# Altium schematic sheet MCUCircuit.SchDoc
size A2; SheetNumber: 5; SheetTotal: 9
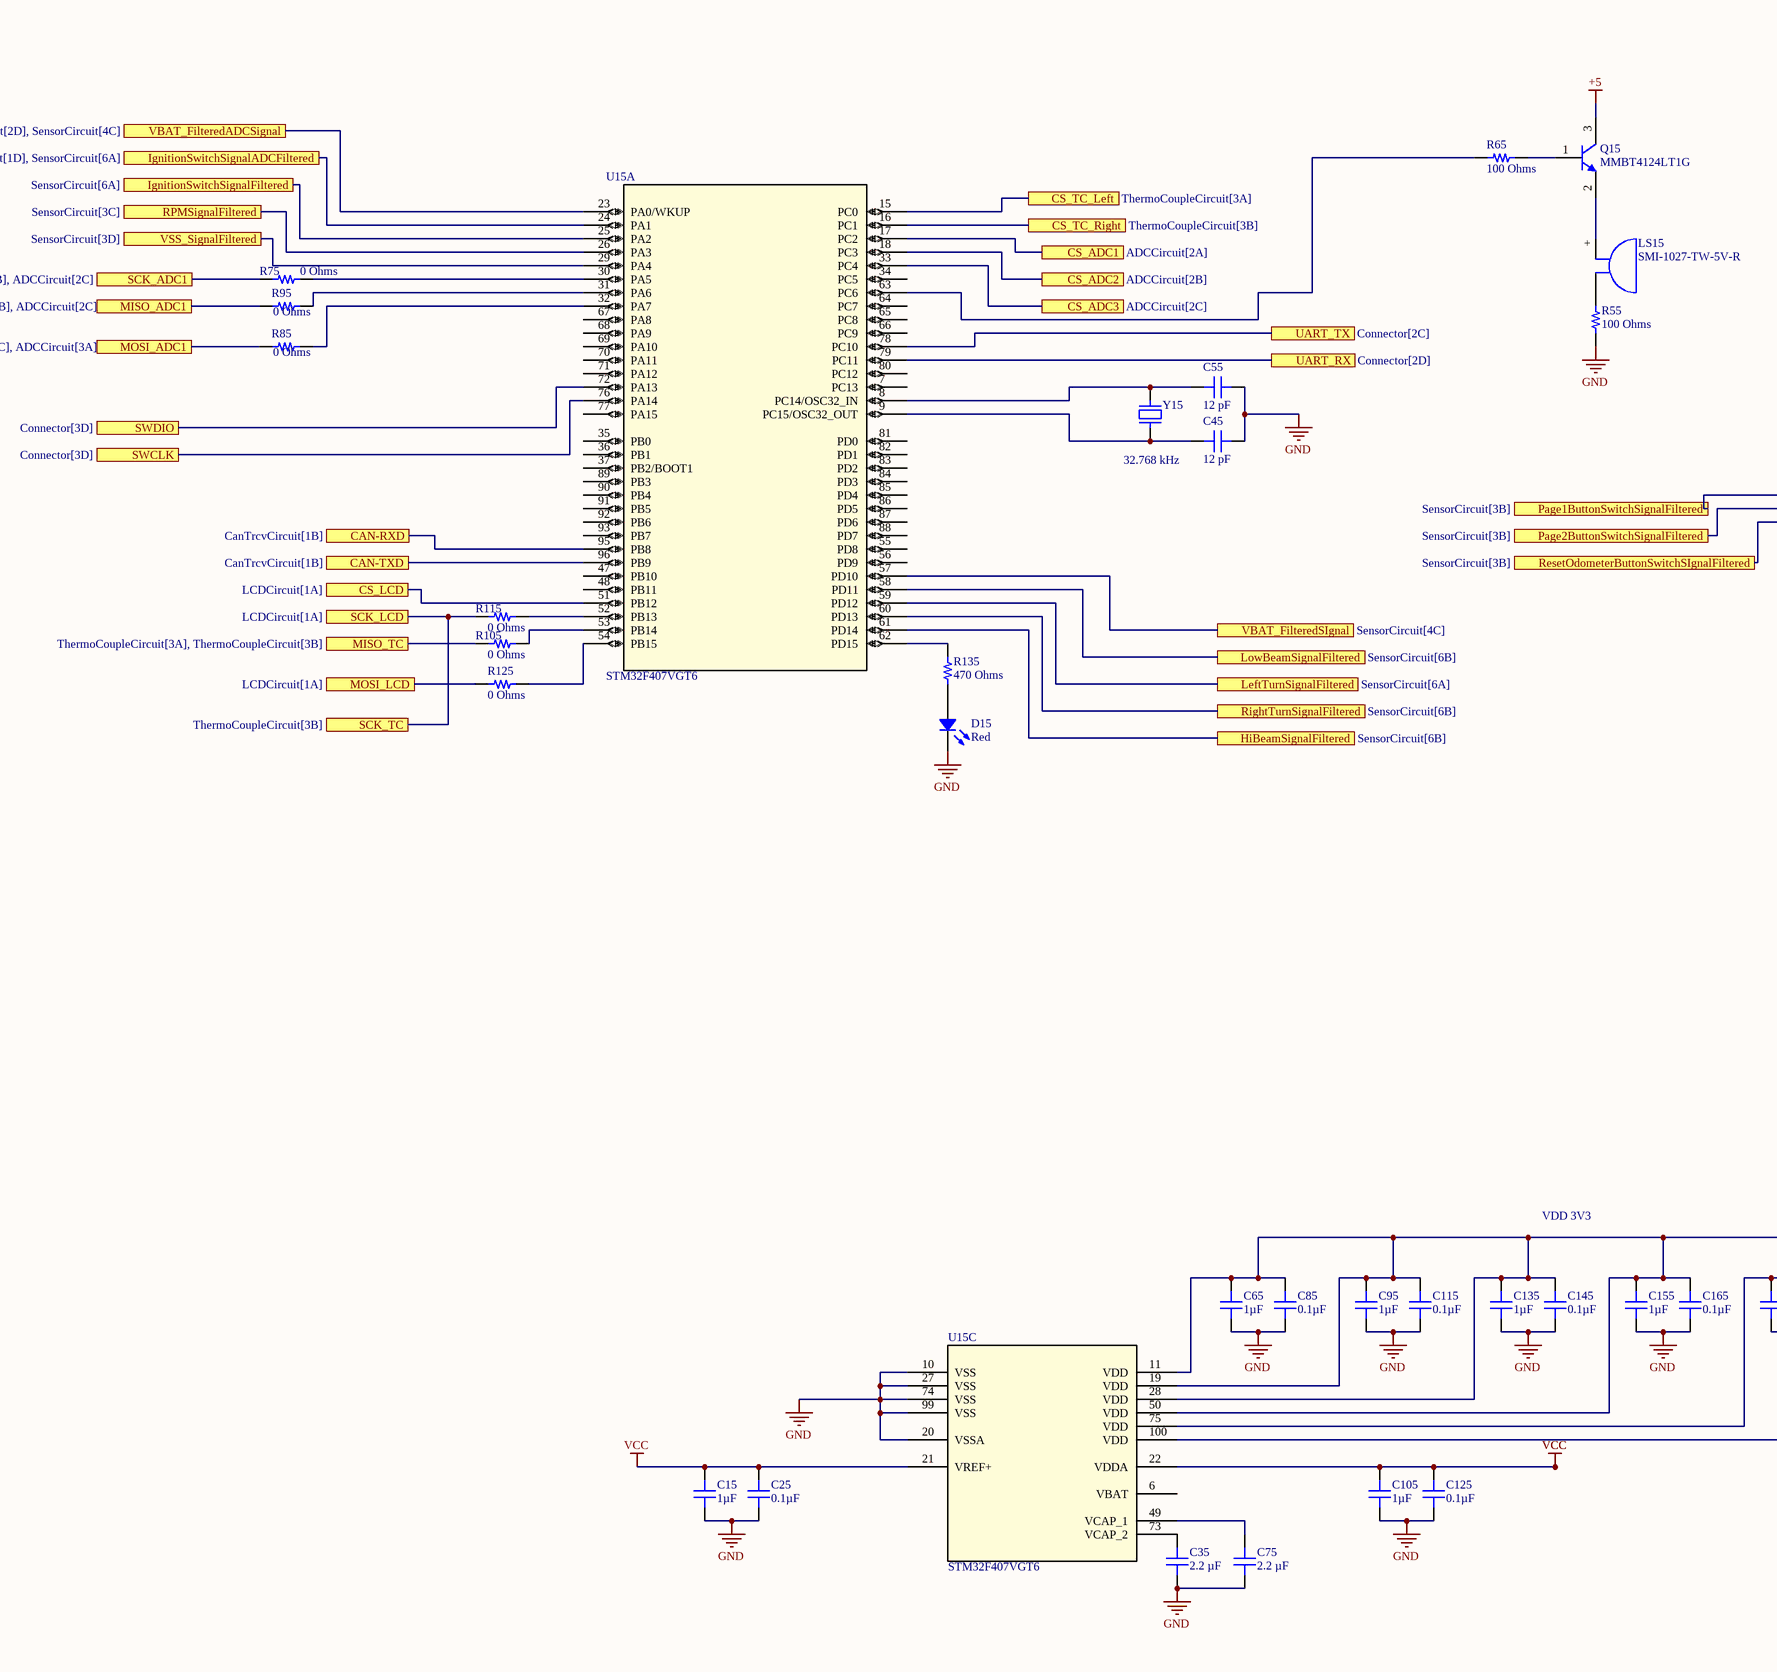
[diagram p0: MCUCircuit.SchDoc, left]
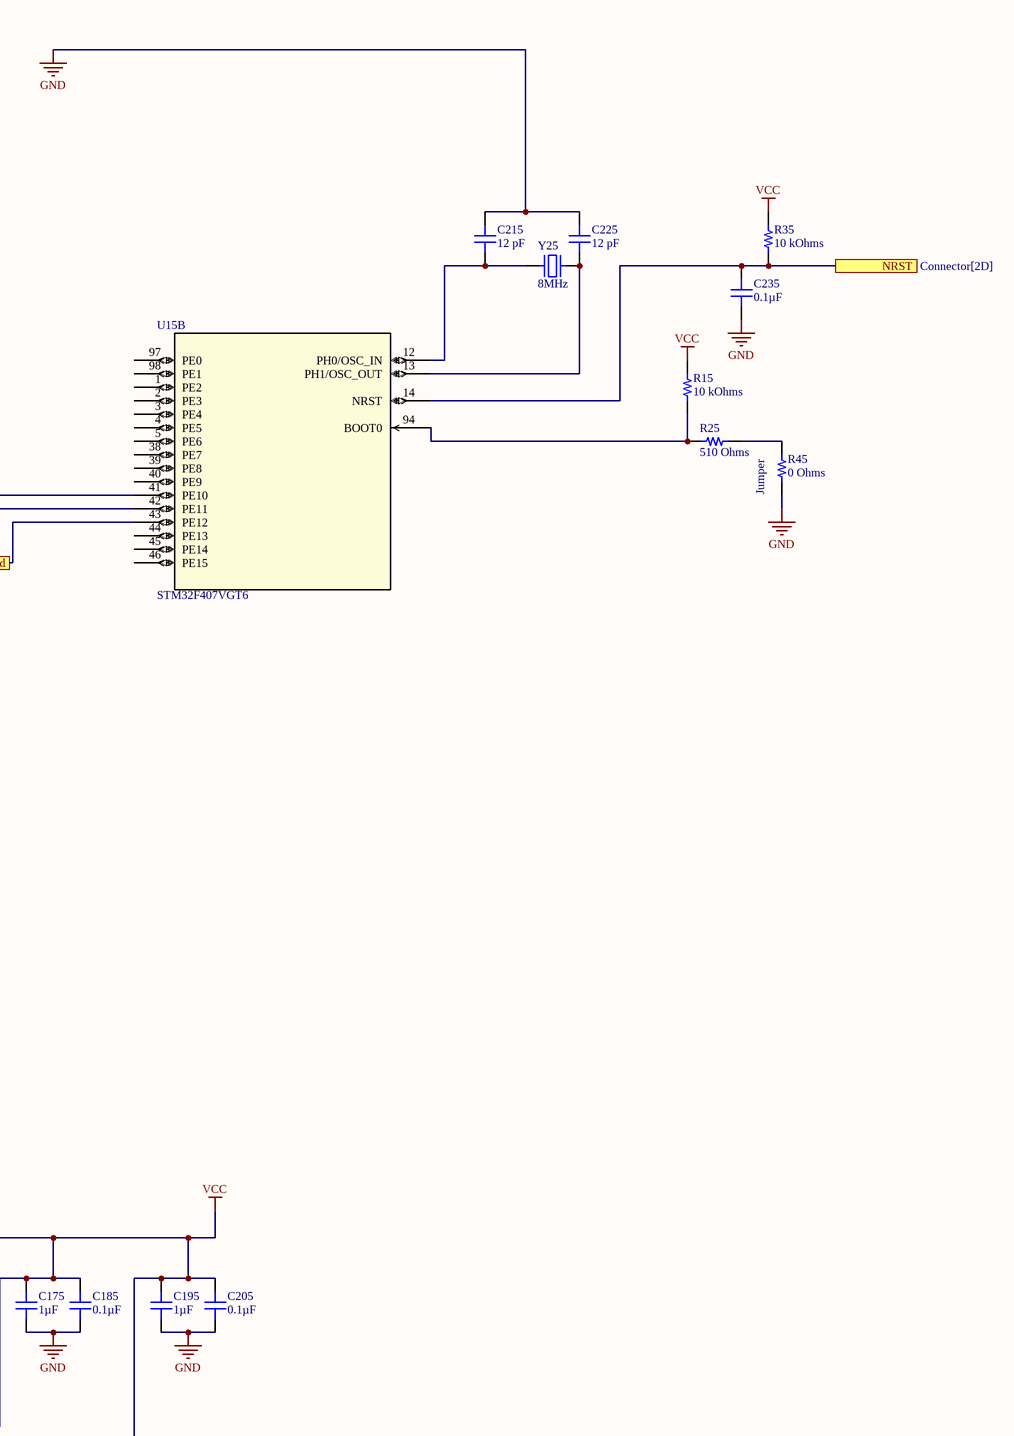
[diagram p1: MCUCircuit.SchDoc, right]

## Parts
C15  1µF  [C0805]
C25  0.1µF  [C0805]
C35  2.2 µF  [C0805]
C45  12 pF  [C0805]
C55  12 pF  [C0805]
C65  1µF  [C0805]
C75  2.2 µF  [C0805]
C85  0.1µF  [C0805]
C95  1µF  [C0805]
C105  1µF  [C0805]
C115  0.1µF  [C0805]
C125  0.1µF  [C0805]
C135  1µF  [C0805]
C145  0.1µF  [C0805]
C155  1µF  [C0805]
C165  0.1µF  [C0805]
C175  1µF  [C0805]
C185  0.1µF  [C0805]
C195  1µF  [C0805]
C205  0.1µF  [C0805]
C215  12 pF  [C0805]
C225  12 pF  [C0805]
C235  0.1µF  [C0805]
D15  Red  [LED 1206_3216 RED]
LS15  SMI-1027-TW-5V-R  [PUI Audio SMI-1027-TW-5V-R]
Q15  MMBT4124LT1G  [ON SEMI SOT-23-3]
R15  10 kOhms  [RES 0805_2012]
R25  510 Ohms  [RES 0805_2012]
R35  10 kOhms  [RES 0805_2012]
R45  0 Ohms  [RES 0805_2012]
R55  100 Ohms  [RES 0805_2012]
R65  100 Ohms  [RES 0805_2012]
R75  0 Ohms  [RES 0805_2012]
R85  0 Ohms  [RES 0805_2012]
R95  0 Ohms  [RES 0805_2012]
R105  0 Ohms  [RES 0805_2012]
R115  0 Ohms  [RES 0805_2012]
R125  0 Ohms  [RES 0805_2012]
R135  470 Ohms  [RES 0805_2012]
U15  STM32F407VGT6  [LQFP100-14x14mm]  (parts A,B,C of 3)
Y15  32.768 kHz  [MICRO CRYSTAL CM8V H0.6mm]
Y25  8MHz  [NDK NX8045GB]

## Ports
CAN-RXD (see CanTrcvCircuit[1B]), CAN-TXD (see CanTrcvCircuit[1B]), CS_ADC1 (see ADCCircuit[2A]), CS_ADC2 (see ADCCircuit[2B]), CS_ADC3 (see ADCCircuit[2C]), CS_LCD (see LCDCircuit[1A]), CS_TC_Left (see ThermoCoupleCircuit[3A]), CS_TC_Right (see ThermoCoupleCircuit[3B]), HiBeamSignalFiltered (see SensorCircuit[6B]), IgnitionSwitchSignalADCFiltered (see ADCCircuit[1D], SensorCircuit[6A]), IgnitionSwitchSignalFiltered (see SensorCircuit[6A]), LeftTurnSignalFiltered (see SensorCircuit[6A]), LowBeamSignalFiltered (see SensorCircuit[6B]), MISO_ADC1 (see ADCCircuit[2A], ADCCircuit[2B], ADCCircuit[2C]), MISO_TC (see ThermoCoupleCircuit[3A], ThermoCoupleCircuit[3B]), MOSI_ADC1 (see ADCCircuit[2B], ADCCircuit[2C], ADCCircuit[3A]), MOSI_LCD (see LCDCircuit[1A]), NRST (see Connector[2D]), Page1ButtonSwitchSignalFiltered (see SensorCircuit[3B]), Page2ButtonSwitchSignalFiltered (see SensorCircuit[3B]), ResetOdometerButtonSwitchSIgnalFiltered (see SensorCircuit[3B]), RightTurnSignalFiltered (see SensorCircuit[6B]), RPMSignalFiltered (see SensorCircuit[3C]), SCK_ADC1 (see ADCCircuit[2A], ADCCircuit[2B], ADCCircuit[2C]), SCK_LCD (see LCDCircuit[1A]), SCK_TC (see ThermoCoupleCircuit[3B]), SWCLK (see Connector[3D]), SWDIO (see Connector[3D]), UART_RX (see Connector[2D]), UART_TX (see Connector[2C]), VBAT_FilteredADCSignal (see ADCCircuit[2D], SensorCircuit[4C]), VBAT_FilteredSIgnal (see SensorCircuit[4C]), VSS_SignalFiltered (see SensorCircuit[3D])

## Nets
+5: Q15.3(C)
GND: C15.1 C25.1 C35.2 C45.2 C55.2 C65.1 C75.2 C85.1 C95.1 C105.1 C115.1 C125.1 C135.1 C145.1 C155.1 C165.1 C175.1 C185.1 C195.1 C205.1 C215.2 C225.2 C235.1 D15.2 R45.1 R55.1 U15.10(VSS) U15.20(VSSA) U15.27(VSS) U15.74(VSS) U15.99(VSS)
VCC: C15.2 C25.2 C65.2 C85.2 C95.2 C105.2 C115.2 C125.2 C135.2 C145.2 C155.2 C165.2 C175.2 C185.2 C195.2 C205.2 R15.2 R35.2 U15.11(VDD) U15.19(VDD) U15.21(VREF+) U15.22(VDDA) U15.28(VDD) U15.50(VDD) U15.75(VDD) U15.100(VDD)
CAN-RXD: U15.95(PB8) ; port CAN-RXD
CAN-TXD: U15.96(PB9) ; port CAN-TXD
CS_ADC1: U15.17(PC2) ; port CS_ADC1
CS_ADC2: U15.18(PC3) ; port CS_ADC2
CS_ADC3: U15.33(PC4) ; port CS_ADC3
CS_LCD: U15.51(PB12) ; port CS_LCD
CS_TC_Left: U15.15(PC0) ; port CS_TC_Left
CS_TC_Right: U15.16(PC1) ; port CS_TC_Right
HiBeamSignalFiltered: U15.61(PD14) ; port HiBeamSignalFiltered
IgnitionSwitchSignalADCFiltered: U15.24(PA1) ; port IgnitionSwitchSignalADCFiltered
IgnitionSwitchSignalFiltered: U15.25(PA2) ; port IgnitionSwitchSignalFiltered
LeftTurnSignalFiltered: U15.59(PD12) ; port LeftTurnSignalFiltered
LowBeamSignalFiltered: U15.58(PD11) ; port LowBeamSignalFiltered
MISO_ADC1: R95.1 ; port MISO_ADC1
MISO_TC: R105.1 ; port MISO_TC
MOSI_ADC1: R85.1 ; port MOSI_ADC1
MOSI_LCD: R125.1 ; port MOSI_LCD
NRST: C235.2 R35.1 U15.14(NRST) ; port NRST
Page1ButtonSwitchSignalFiltered: U15.41(PE10) ; port Page1ButtonSwitchSignalFiltered
Page2ButtonSwitchSignalFiltered: U15.42(PE11) ; port Page2ButtonSwitchSignalFiltered
ResetOdometerButtonSwitchSIgnalFiltered: U15.43(PE12) ; port ResetOdometerButtonSwitchSIgnalFiltered
RightTurnSignalFiltered: U15.60(PD13) ; port RightTurnSignalFiltered
RPMSignalFiltered: U15.26(PA3) ; port RPMSignalFiltered
SCK_ADC1: R75.1 ; port SCK_ADC1
SCK_LCD: R115.1 ; port SCK_LCD, port SCK_TC
SWCLK: U15.76(PA14) ; port SWCLK
SWDIO: U15.72(PA13) ; port SWDIO
UART_RX: U15.79(PC11) ; port UART_RX
UART_TX: U15.78(PC10) ; port UART_TX
VBAT_FilteredADCSignal: U15.23(PA0/WKUP) ; port VBAT_FilteredADCSignal
VBAT_FilteredSIgnal: U15.57(PD10) ; port VBAT_FilteredSIgnal
VSS_SignalFiltered: U15.29(PA4) ; port VSS_SignalFiltered
NetC35_1: C35.1 U15.73(VCAP_2)
NetC45_1: C45.1 U15.9(PC15/OSC32_OUT) Y15.1
NetC55_1: C55.1 U15.8(PC14/OSC32_IN) Y15.2
NetC75_1: C75.1 U15.49(VCAP_1)
NetC215_1: C215.1 U15.12(PH0/OSC_IN) Y25.1
NetC225_1: C225.1 U15.13(PH1/OSC_OUT) Y25.2
NetD15_1: D15.1 R135.1
NetLS15_+: LS15.+ Q15.2(E)
NetLS15_-: LS15.- R55.2
NetQ15_1: Q15.1(B) R65.1
NetR15_1: R15.1 R25.1 U15.94(BOOT0)
NetR25_2: R25.2 R45.2
NetR65_2: R65.2 U15.63(PC6)
NetR75_2: R75.2 U15.30(PA5)
NetR85_2: R85.2 U15.32(PA7)
NetR95_2: R95.2 U15.31(PA6)
NetR105_2: R105.2 U15.53(PB14)
NetR115_2: R115.2 U15.52(PB13)
NetR125_2: R125.2 U15.54(PB15)
NetR135_2: R135.2 U15.62(PD15)

Not connected (* = marked no-connect by the designer): U15 1(PE2) 2(PE3) 3(PE4) 4(PE5) 5(PE6) 6(VBAT) 7(PC13) 34(PC5) 35(PB0) 36(PB1) 37(PB2/BOOT1) 38(PE7) 39(PE8) 40(PE9) 44(PE13) 45(PE14) 46(PE15) 47(PB10) 48(PB11) 55(PD8) 56(PD9) 64(PC7) 65(PC8) 66(PC9) 67(PA8) 68(PA9) 69(PA10) 70(PA11) 71(PA12) 77(PA15) 80(PC12) 81(PD0) 82(PD1) 83(PD2) 84(PD3) 85(PD4) 86(PD5) 87(PD6) 88(PD7) 89(PB3) 90(PB4) 91(PB5) 92(PB6) 93(PB7) 97(PE0) 98(PE1)

## Notes on the sheet
- (near R45) Jumper
- VDD 3V3

## Library data of the parts
C15 C65 C95 C105 C135 C155 C175 C195 = LGC26D105MAT2S1: CAP CER 1UF 6.3V X5R 0805; manufacturer: AVX Corporation; Tolerance: ±20%; Part Number: LGC26D105MAT2S1; Value: 1µF; Applications: Bypass, Decoupling; Capacitance: 1µF; componentlink1description: Datasheet; componentlink1url: http://datasheets.avx.com/LGA.pdf; componentlink2description: DigiKey Link; componentlink2url: http://digikey.com/product-detail/en/avx-corporation/LGC26D105MAT2S1/478-6694-1-ND/2694148; Device Package: 0805 (2012 Metric); Features: Low ESL (Multi-Terminal); lastupdated: 9/2/2020 01:04:42; Lifecycle Status: Active; Minimum Order: 1; Mounting Type: Surface Mount, MLCC; Operating Temperature: -55°C ~ 85°C; Package / Case: 0805 (2012 Metric); packaging: TapeAndReel; partid: 2463; Part Status: Active; price: 0.63; series: LGC2 (LGA); Size / Dimension: 0.081" L x 0.052" W (2.06mm x 1.32mm); Supplier 1: DigiKey; Supplier Part Number 1: 478-6694-1-ND; Temperature Coefficient: X5R; Thickness (Max): 0.022" (0.55mm); Voltage - Rated: 6.3V
C25 C85 C115 C125 C145 C165 C185 C205 C235 = 08056C104JAZ2A: CAP CER 0.1UF 6.3V X7R 0805; manufacturer: AVX Corporation; Tolerance: ±5%; Part Number: 08056C104JAZ2A; Value: 0.1µF; Applications: Boardflex Sensitive; Capacitance: 0.1µF; componentlink1description: Datasheet; componentlink1url: http://datasheets.avx.com/FlexitermMLCC.pdf; componentlink2description: DigiKey Link; componentlink2url: http://digikey.com/product-detail/en/avx-corporation/08056C104JAZ2A/478-11914-1-ND/8573550; Device Package: 0805 (2012 Metric); Features: Soft Termination; lastupdated: 9/2/2020 01:04:11; Lifecycle Status: Active; Minimum Order: 1; Mounting Type: Surface Mount, MLCC; Operating Temperature: -55°C ~ 125°C; Package / Case: 0805 (2012 Metric); packaging: TapeAndReel; partid: 16783; Part Status: Active; price: 0.08; series: FLEXITERM®; Size / Dimension: 0.079" L x 0.049" W (2.01mm x 1.25mm); Supplier 1: DigiKey; Supplier Part Number 1: 478-11914-1-ND; Temperature Coefficient: X7R; Voltage - Rated: 6.3V
C35 C75 = VJ0805G225KXYTW1BC: CAP CER 2.2UF 6.3V X5R 0805; manufacturer: Vishay Vitramon; Tolerance: ±10%; Part Number: VJ0805G225KXYTW1BC; Value: 2.2 µF; Applications: General Purpose; Capacitance: 2.2 µF; componentlink1description: Datasheet; componentlink1url: https://www.vishay.com/docs/28548/vjw1bcbascomseries.pdf; componentlink2description: DigiKey Link; componentlink2url: https://www.digikey.com/en/products/detail/vishay-vitramon/VJ0805G225KXYTW1BC/8310442; Device Package: 0805 (2012 Metric); lastupdated: 2/9/2024 20:16:05; Lifecycle Status: Active; Minimum Order: 1; Mounting Type: Surface Mount, MLCC; Operating Temperature: -55°C ~ 85°C; Package / Case: 0805 (2012 Metric); packaging: TapeAndReel; partid: 3978; Part Status: Active; price: 0.08; series: VJ W1BC; Size / Dimension: 0.079" L x 0.049" W (2.00mm x 1.25mm); Supplier 1: DigiKey; Supplier Part Number 1: 720-1727-1-ND; Temperature Coefficient: X5R; Thickness (Max): 0.057" (1.45mm); Voltage - Rated: 6.3V
C45 C55 C215 C225 = C0805C120J8HAC7800: CAP CER 12PF 10V X8R 0805; manufacturer: KEMET; Tolerance: ±5%; Part Number: C0805C120J8HAC7800; Value: 12 pF; Applications: General Purpose; Capacitance: 12 pF; componentlink1description: Datasheet; componentlink1url: https://api.kemet.com/component-edge/download/datasheet/C0805C120J8HAC7800.pdf; componentlink2description: DigiKey Link; componentlink2url: https://www.digikey.com/en/products/detail/kemet/C0805C120J8HAC7800/7948305; Device Package: 0805 (2012 Metric); Features: Low ESL, High Temperature; lastupdated: 2/9/2024 20:15:06; Lifecycle Status: Active; Minimum Order: 1; Mounting Type: Surface Mount, MLCC; Operating Temperature: -55°C ~ 150°C; Package / Case: 0805 (2012 Metric); packaging: TapeAndReel; partid: 32071; Part Status: Active; price: 0.01; series: SMD Comm X8R HT150C; Size / Dimension: 0.079" L x 0.049" W (2.00mm x 1.25mm); Supplier 1: DigiKey; Supplier Part Number 1: 399-C0805C120J8HAC7800CT-ND; Temperature Coefficient: X8R; Thickness (Max): 0.035" (0.88mm); Voltage - Rated: 10V
D15 = 25-21/R6C-BR2S2B/2A: LED RED CLEAR 1206 SMD; Manufacturer: Everlight Electronics Co Ltd; Current - Test: 20mA; Lens Color: Colorless; Lens Size: 1.10mm Dia; Lens Style: Round with Domed Top; Millicandela Rating: 212.5mcd; Viewing Angle: 60°; Voltage - Forward (Vf) (Typ): 2.05V; Wavelength - Dominant: 624nm; Wavelength - Peak: 632nm; Part Number: 25-21/R6C-BR2S2B/2A; Color: Red; ComponentLink1Description: Datasheet; ComponentLink1URL: https://everlighteurope.com/index.php?controller=attachment&id_attachment=6134; ComponentLink2Description: DigiKey Link; ComponentLink2URL: https://www.digikey.com/en/products/detail/everlight-electronics-co-ltd/25-21-R6C-BR2S2B-2A/12177238; Device Package: 1206 (3216 Metric); Height (Max): 1.20mm; LastUpdated: 6/3/2024 20:00:40; Lens Transparency: Clear; Lifecycle Status: Active; Minimum Order: 1; Mounting Type: Surface Mount; Package / Case: 1206 (3216 Metric); Packaging: TapeAndReel; PartId: 1100; Part Status: Active; Price: 0.05; Series: -; Size / Dimension: 3.20mm L x 1.60mm W; Supplier 1: DigiKey; Supplier Part Number 1: 1080-25-21/R6C-BR2S2B/2ACT-ND; Supplier Device Package: 1206; Value: Red
LS15 = SMI-1027-TW-5V-R: AUDIO MAGNETIC IND 4-7V SMD; Manufacturer: PUI Audio, Inc.; Current - Supply: 30mA; Driver Circuitry: Indicator, Internally Driven; Frequency: 2.7kHz; Input Type: DC; Operating Mode: Single Tone; Port Location: Top; Ratings: Washable; Sound Pressure Level (SPL): 80dB @ 5V, 10cm; Voltage Range: 4 ~ 7V; Voltage - Rated: 5V; Part Number: SMI-1027-TW-5V-R; ComponentLink1Description: Datasheet; ComponentLink1URL: http://www.puiaudio.com/pdf/SMI-1027-TW-5V-R.pdf; ComponentLink2Description: DigiKey Link; ComponentLink2URL: http://digikey.com/product-detail/en/pui-audio-inc/SMI-1027-TW-5V-R/668-1537-1-ND/6021768; Height - Seated (Max): 0.209" (5.30mm); LastUpdated: 4/24/2020 00:38:54; Lifecycle Status: Active; Minimum Order: 1; Mounting Type: Surface Mount; Operating Temperature: -40°C ~ 85°C; Packaging: TapeAndReel; Part Status: Active; Price: 2.15; Series: SMI; Size / Dimension: 0.378" L x 0.378" W (9.60mm x 9.60mm); Supplier 1: DigiKey; Supplier Part Number 1: 668-1537-1-ND; Technology: Magnetic; Termination: Solder Pads
Q15 = MMBT4124LT1G: TRANS NPN 25V 0.2A SOT23-3; Manufacturer: ON Semiconductor; Current - Collector Cutoff (Max): 50nA (ICBO); Current - Collector (Ic) (Max): 200mA; DC Current Gain (hFE) (Min) @ Ic, Vce: 120 @ 2mA, 1V; Frequency - Transition: 300MHz; Power - Max: 225mW; Vce Saturation (Max) @ Ib, Ic: 300mV @ 5mA, 50mA; Part Number: MMBT4124LT1G; ComponentLink1Description: Datasheet; ComponentLink1URL: http://www.onsemi.com/pub/Collateral/MMBT4124LT1-D.PDF; ComponentLink2Description: DigiKey Link; ComponentLink2URL: http://digikey.com/product-detail/en/on-semiconductor/MMBT4124LT1G/MMBT4124LT1GOSCT-ND/2705123; LastUpdated: 3/11/2024 08:12:30; Lifecycle Status: Active; Minimum Order: 1; Mounting Type: Surface Mount; Operating Temperature: -55°C ~ 150°C (TJ); Package / Case: TO-236-3, SC-59, SOT-23-3; Packaging: TapeAndReel; PartId: 139; Part Status: Active; Price: 0.03; Series: -; Supplier 1: DigiKey; Supplier Part Number 1: MMBT4124LT1GOSCT-ND; Supplier Device Package: SOT-23-3 (TO-236); Transistor Type: NPN; Voltage - Collector Emitter Breakdown (Max): 25V
R15 R35 = AC0805JR-0710KL: RES SMD 10K OHM 5% 1/8W 0805; Manufacturer: Yageo; Power (Watts): 0.125W, 1/8W; Temperature Coefficient: ±100ppm/°C; Part Number: AC0805JR-0710KL; Value: 10 kOhms; ComponentLink1Description: Datasheet; ComponentLink1URL: https://www.yageo.com/upload/media/product/productsearch/datasheet/rchip/PYu-AC_51_RoHS_L_7.pdf; ComponentLink2Description: DigiKey Link; ComponentLink2URL: https://www.digikey.com/en/products/detail/yageo/AC0805JR-0710KL/5897043; Composition: Thick Film; Device Package: 0805 (2012 Metric); Features: Automotive AEC-Q200, Moisture Resistant; Height - Seated (Max): 0.024" (0.60mm); LastUpdated: 2/8/2024 21:01:11; Lifecycle Status: Active; Minimum Order: 1; Number of Terminations: 2; Operating Temperature: -55°C ~ 155°C; Package / Case: 0805 (2012 Metric); Packaging: TapeAndReel; PartId: 47032; Part Status: Active; Price: 0.01; Ratings: AEC-Q200; Resistance: 10 kOhms; Series: AC; Size / Dimension: 0.079" L x 0.049" W (2.00mm x 1.25mm); Supplier 1: DigiKey; Supplier Part Number 1: YAG3758CT-ND; Supplier Device Package: 0805; Tolerance: ±5%
R25 = 3430A2F510RTDF: 3430 A2 1% 510R 100PPM 1K RL; Manufacturer: TE Connectivity Passive Product; Power (Watts): 1W; Temperature Coefficient: ±100ppm/°C; Part Number: 3430A2F510RTDF; Value: 510 Ohms; ComponentLink2Description: DigiKey Link; ComponentLink2URL: https://www.digikey.com/en/products/detail/te-connectivity-passive-product/3430A2F510RTDF/17763734; Composition: Thick Film; Device Package: 0805 (2012 Metric); Features: Automotive AEC-Q200; Height - Seated (Max): 0.026" (0.65mm); LastUpdated: 2/8/2024 21:00:03; Lifecycle Status: Active; Minimum Order: 1; Number of Terminations: 2; Operating Temperature: -55°C ~ 155°C; Package / Case: 0805 (2012 Metric); Packaging: TapeAndReel; PartId: 77774; Part Status: Active; Price: 0.02; Ratings: AEC-Q200; Resistance: 510 Ohms; Series: 3430; Size / Dimension: 0.049" L x 0.079" W (1.25mm x 2.00mm); Supplier 1: DigiKey; Supplier Part Number 1: 1712-3430A2F510RTDFCT-ND; Supplier Device Package: 0508; Tolerance: ±1%
R45 = AA0805JR-070RL: RES SMD 0 OHM JUMPER 1/8W 0805; Manufacturer: Yageo; Part Number: AA0805JR-070RL; Value: 0 Ohms; ComponentLink1Description: Datasheet; ComponentLink1URL: https://www.yageo.com/upload/media/product/productsearch/datasheet/rchip/PYu-AA_51_RoHS_L_3.pdf; ComponentLink2Description: DigiKey Link; ComponentLink2URL: https://www.digikey.com/en/products/detail/yageo/AA0805JR-070RL/5890455; Composition: Thick Film; Device Package: 0805 (2012 Metric); Features: Anti-Sulfur, Automotive AEC-Q200, Moisture Resistant; Height - Seated (Max): 0.024" (0.60mm); LastUpdated: 2/8/2024 21:00:22; Lifecycle Status: Active; Minimum Order: 1; Number of Terminations: 2; Operating Temperature: -55°C ~ 155°C; Package / Case: 0805 (2012 Metric); Packaging: TapeAndReel; PartId: 74756; Part Status: Active; Price: 0.01; Ratings: AEC-Q200; Resistance: 0 Ohms; Series: AA; Size / Dimension: 0.079" L x 0.049" W (2.00mm x 1.25mm); Supplier 1: DigiKey; Supplier Part Number 1: 13-AA0805JR-070RLCT-ND; Supplier Device Package: 0805; Tolerance: Jumper
R55 R65 = AC0805FR-7W100RL: RES 100 OHM 1% 1/4W 0805; Manufacturer: Yageo; Power (Watts): 0.25W, 1/4W; Temperature Coefficient: ±100ppm/°C; Part Number: AC0805FR-7W100RL; Value: 100 Ohms; ComponentLink1Description: Datasheet; ComponentLink1URL: https://www.yageo.com/upload/media/product/productsearch/datasheet/rchip/PYu-AC_51_RoHS_L_8.pdf; ComponentLink2Description: DigiKey Link; ComponentLink2URL: https://www.digikey.com/en/products/detail/yageo/AC0805FR-7W100RL/12698833; Composition: Thick Film; Device Package: 0805 (2012 Metric); Features: Automotive AEC-Q200, Moisture Resistant; Height - Seated (Max): 0.024" (0.60mm); LastUpdated: 2/8/2024 21:00:29; Lifecycle Status: Active; Minimum Order: 1; Number of Terminations: 2; Operating Temperature: -55°C ~ 155°C; Package / Case: 0805 (2012 Metric); Packaging: TapeAndReel; PartId: 60606; Part Status: Active; Price: 0.01; Ratings: AEC-Q200; Resistance: 100 Ohms; Series: AC; Size / Dimension: 0.079" L x 0.049" W (2.00mm x 1.25mm); Supplier 1: DigiKey; Supplier Part Number 1: 13-AC0805FR-7W100RLCT-ND; Supplier Device Package: 0805; Tolerance: ±1%
R75 R85 R95 R105 R115 R125 = WJC0805LJUMPFNR: RES 0 OHM JUMPER 0805; Manufacturer: Littelfuse Inc.; Part Number: WJC0805LJUMPFNR; Value: 0 Ohms; ComponentLink1Description: Datasheet; ComponentLink1URL: https://media.digikey.com/pdf/Data%20Sheets/Littelfuse%20PDFs/WJC_Series_3-17-23.pdf; ComponentLink2Description: DigiKey Link; ComponentLink2URL: https://www.digikey.com/en/products/detail/littelfuse-inc/WJC0805LJUMPFNR/18795443; Composition: Metal Foil; Device Package: 0805 (2012 Metric); Features: Current Sense, High Voltage; Height - Seated (Max): 0.024" (0.60mm); LastUpdated: 2/8/2024 20:59:56; Lifecycle Status: Active; Minimum Order: 1; Number of Terminations: 2; Operating Temperature: -55°C ~ 170°C; Package / Case: 0805 (2012 Metric); Packaging: TapeAndReel; PartId: 80166; Price: 0.07; Resistance: 0 Ohms; Series: WJC; Size / Dimension: 0.079" L x 0.049" W (2.00mm x 1.25mm); Supplier 1: DigiKey; Supplier Part Number 1: 18-WJC0805LJUMPFNRCT-ND; Supplier Device Package: 0805; Tolerance: Jumper
R135 = AC0805FR-7W470RL: RES 470 OHM 1% 1/4W 0805; Manufacturer: Yageo; Power (Watts): 0.25W, 1/4W; Temperature Coefficient: ±100ppm/°C; Part Number: AC0805FR-7W470RL; Value: 470 Ohms; ComponentLink1Description: Datasheet; ComponentLink1URL: https://www.yageo.com/upload/media/product/productsearch/datasheet/rchip/PYu-AC_51_RoHS_L_9.pdf; ComponentLink2Description: DigiKey Link; ComponentLink2URL: https://www.digikey.com/en/products/detail/yageo/AC0805FR-7W470RL/16982114; Composition: Thick Film; Device Package: 0805 (2012 Metric); Features: Automotive AEC-Q200, Moisture Resistant; Height - Seated (Max): 0.024" (0.60mm); LastUpdated: 2/8/2024 21:00:08; Lifecycle Status: Active; Minimum Order: 1; Number of Terminations: 2; Operating Temperature: -55°C ~ 155°C; Package / Case: 0805 (2012 Metric); Packaging: TapeAndReel; PartId: 76423; Part Status: Active; Price: 0.01; Ratings: AEC-Q200; Resistance: 470 Ohms; Series: AC; Size / Dimension: 0.079" L x 0.049" W (2.00mm x 1.25mm); Supplier 1: DigiKey; Supplier Part Number 1: 13-AC0805FR-7W470RLCT-ND; Supplier Device Package: 0805; Tolerance: ±1%
U15 = STM32F407VGT6: No Description Available; Mfr_Name: STMicroelectronics; RefDes: RefDes; Type: Type
Y15 = CM8V-T1A-32.768KHZ-12.5PF-20PPM-TA-QA: CRYSTAL 32.7680KHZ 12.5PF SMD; Manufacturer: Micro Crystal AG; ESR (Equivalent Series Resistance): 70 kOhms; Frequency Tolerance: ±20ppm; Operating Mode: Fundamental; Part Number: CM8V-T1A-32.768KHZ-12.5PF-20PPM-TA-QA; ComponentLink1Description: Datasheet; ComponentLink1URL: https://www.microcrystal.com/fileadmin/Media/Products/32kHz/Datasheet/CM8V-T1A.pdf; ComponentLink2Description: DigiKey Link; ComponentLink2URL: https://www.digikey.com/en/products/detail/micro-crystal-ag/CM8V-T1A-32-768KHZ-12-5PF-20PPM-TA-QA/10499086; Frequency: 32.768 kHz; Height - Seated (Max): 0.024" (0.60mm); LastUpdated: 3/11/2024 08:14:55; Lifecycle Status: Active; Load Capacitance: 12.5pF; Minimum Order: 1; Mounting Type: Surface Mount; Operating Temperature: -40°C ~ 85°C; Package / Case: 2-SMD, No Lead; Packaging: TapeAndReel; PartId: 834; Part Status: Active; Price: 0.30; Ratings: AEC-Q200; Series: CM8V; Size / Dimension: 0.079" L x 0.047" W (2.00mm x 1.20mm); Supplier 1: DigiKey; Supplier Part Number 1: 2195-CM8V-T1A-32.768KHZ-12.5PF-20PPM-TA-QACT-ND; Type: kHz Crystal (Tuning Fork); Value: 32.768 kHz
Y25 = NX8045GB-8.000000MHZ: CRYSTAL 8.0000MHZ 8PF SMD; Manufacturer: NDK America, Inc.; ESR (Equivalent Series Resistance): 200 Ohms; Frequency Stability: ±50ppm; Operating Mode: Fundamental; Part Number: NX8045GB-8.000000MHZ; ComponentLink1Description: Datasheet; ComponentLink1URL: //media.digikey.com/pdf/Data%20Sheets/NDK%20PDFs/NX8045GB.pdf; ComponentLink2Description: DigiKey Link; ComponentLink2URL: http://digikey.com/product-detail/en/ndk-america-inc/NX8045GB-8.000000MHZ/644-1018-1-ND/1128890; Frequency: 8MHz; Frequency Tolerance: ±50ppm; Height - Seated (Max): 0.079" (2.00mm); LastUpdated: 3/11/2024 07:54:40; Lifecycle Status: Active; Load Capacitance: 8pF; Minimum Order: 1; Mounting Type: Surface Mount; Operating Temperature: -10°C ~ 70°C; Package / Case: 2-SMD, No Lead; Packaging: TapeAndReel; PartId: 653; Part Status: Active; Price: 0.30; Series: NX8045GB; Size / Dimension: 0.315" L x 0.177" W (8.00mm x 4.50mm); Supplier 1: DigiKey; Supplier Part Number 1: 644-1018-1-ND; Type: MHz Crystal; Value: 8MHz